# EAGLE design TopBee2.0V (EAGLE 6.5.0)
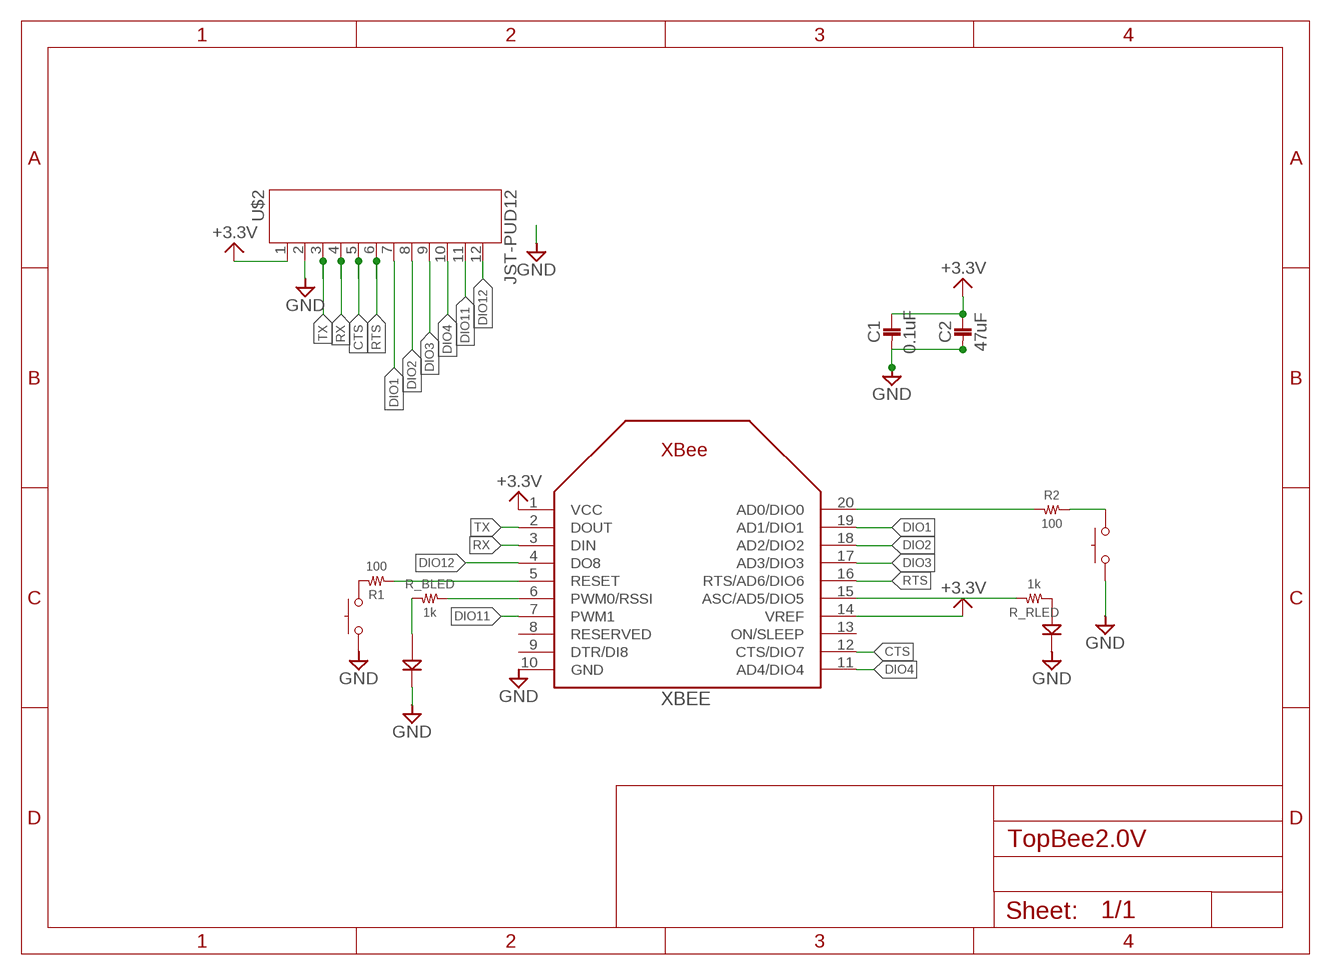
[diagram p0: schematic, sheet 1]

## Parts
C1  0.1uF  1608  [1608]
C2  47uF  3225  [3225]
COMM  SKRPACE010  [SKRP]
LED_B  1608  [1608]
LED_R  1608  [1608]
R1  100  RESISTOR__SMD  [1608]
R2  100  RESISTOR__SMD  [1608]
R_BLED  1k  RESISTOR__SMD  [1608]
R_RLED  1k  RESISTOR__SMD  [1608]
RESET  SKRPACE010  [SKRP]
U$2  JST-PUD12  [JST-PUD12]
XBEE  XBEE  [XBEE]

## Nets
+3.3V: C1.P$1 C2.P$1 U$2.1 XBEE.1(VCC) XBEE.14(VREF)
CTS: U$2.5 XBEE.12(CTS/DIO7)
DIO1: U$2.7 XBEE.19(AD1/DIO1)
DIO2: U$2.8 XBEE.18(AD2/DIO2)
DIO3: U$2.9 XBEE.17(AD3/DIO3)
DIO4: U$2.10 XBEE.11(AD4/DIO4)
DIO11: U$2.11 XBEE.7(PWM1)
DIO12: U$2.12 XBEE.4(DO8)
GND: C1.P$2 C2.P$2 COMM.3 COMM.4 LED_B.2(K) LED_R.2(K) RESET.3 RESET.4 U$2.2 XBEE.10(GND)
N$2: LED_R.1(A) R_RLED.1
N$3: R2.1 XBEE.20(AD0/DIO0)
N$4: R1.1 XBEE.5(RESET)
N$5: R1.2 RESET.1 RESET.2
N$6: COMM.1 COMM.2 R2.2
N$7: R_BLED.2 XBEE.6(PWM0/RSSI)
N$8: R_RLED.2 XBEE.15(ASC/AD5/DIO5)
N$9: LED_B.1(A) R_BLED.1
RTS: U$2.6 XBEE.16(RTS/AD6/DIO6)
RX: U$2.4 XBEE.3(DIN)
TX: U$2.3 XBEE.2(DOUT)
Unconnected: XBEE.8(RESERVED) XBEE.9(DTR/DI8) XBEE.13(ON/SLEEP)

## Library data of the parts
C1 = 02_C:1608
C2 = 02_C:3225
COMM RESET = 09_1_switch:SKRPACE010
LED_B LED_R = 10_LED:1608
R1 R2 R_BLED R_RLED = 01_R:RESISTOR__SMD
U$2 = jst-ph:JST-PUD12
XBEE = adafruit:XBEE

## Board
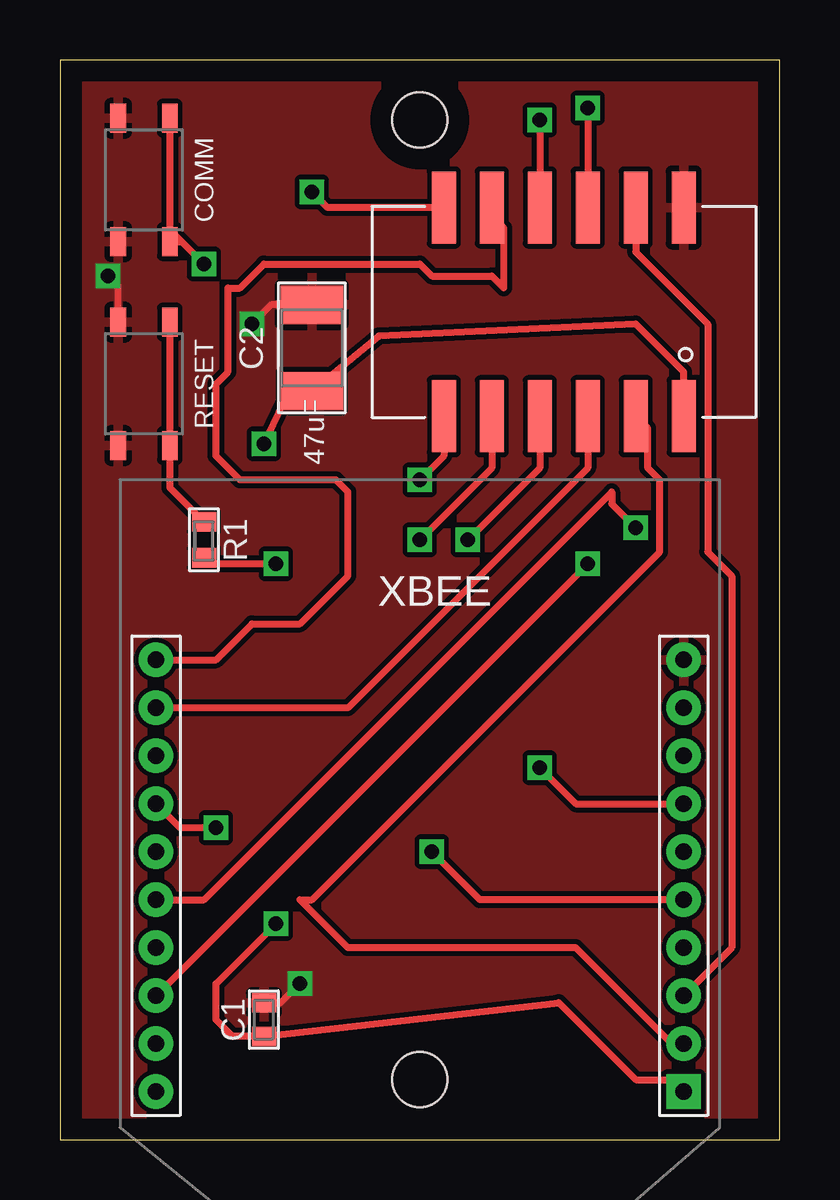
[diagram p1: board, top side]
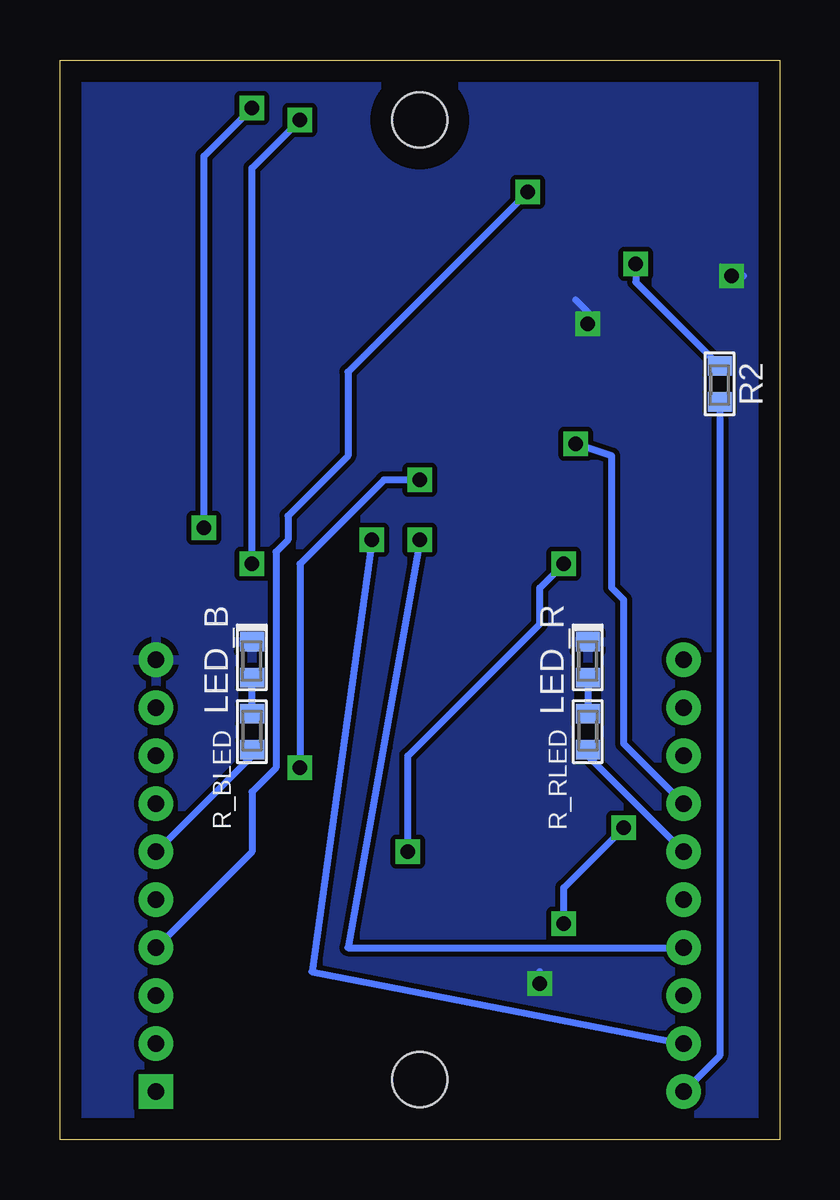
[diagram p2: board, bottom side, seen from below]

Size 30 x 45 mm. Coordinates in mm from the lower left corner, seen from the top.
Outline: 0,0 30,0 30,45 0,45 0,0
Copper layers (1*16): Top 0.035mm / dielectric 1.5mm / Bottom 0.035mm
Design rules "default *": minimum track width 10mil, minimum drill 20mil, track to track 8mil, track to pad 8mil, pad to pad 8mil, via to via 8mil, smd to smd 8mil, copper to edge 0.9mm, drill to drill 8mil, minimum pad ring 10mil, minimum via ring 8mil, stop-mask expansion 4mil, vias tented up to drill 0.5mm, thermal gap 10mil
Holes 2.3 mm at 15,2.5 15,42.5

### Footprints (pad centres in the part's own frame; a part is rotated, then mirrored left to right if it is on the bottom)
1608 = smd 0.8 x 1: P$1 -0.7,0; P$2 0.7,0
3225 = smd 1.6 x 2.6: P$1 -1.8,0; P$2 1.8,0
SKRP = smd 1.2 x 0.65: 1 -2.575,1.075; 2 2.575,1.075; 3 -2.575,-1.075; 4 2.575,-1.075
1608' = smd 0.8 x 1: 1 -0.75,0; 2 0.75,0
JST-PUD12 = smd 1 x 3: 1 5,-4.35; 2 5,4.35; 3 3,-4.35; 4 3,4.35; 5 1,-4.35; 6 1,4.35; 7 -1,-4.35; 8 -1,4.35; 9 -3,-4.35; 10 -3,4.35; 11 -5,-4.35; 12 -5,4.35
XBEE = drill 0.7 pad 1.422 square: 1 -11,5.5 | drill 0.7 pad 1.422: 2 -11,3.5; 3 -11,1.5; 4 -11,-0.5; 5 -11,-2.5; 6 -11,-4.5; 7 -11,-6.5; 8 -11,-8.5; 9 -11,-10.5; 10 -11,-12.5; 11 11,-12.5; 12 11,-10.5; 13 11,-8.5; 14 11,-6.5; 15 11,-4.5; 16 11,-2.5; 17 11,-0.5; 18 11,1.5; 19 11,3.5; 20 11,5.5

### Placement (x,y rotation side)
C1  8.5,5 90 top
C2  10.5,33 90 top
COMM  3.5,40 270 top
LED_B  1608  [1608']  22,20 90 bottom
LED_R  1608  [1608']  8,20 90 bottom
R1  100  [1608']  6,25 90 top
R2  100  [1608']  2.5,31.5 90 bottom
R_BLED  1k  [1608']  22,17 270 bottom
R_RLED  1k  [1608']  8,17 270 bottom
RESET  3.5,31.5 270 top
U$2  21,34.5 0 top
XBEE  15,7.5 180 top

### Tracks (layer width: path | path; a pad name or v marks a point on that pad's centre or on a via)
+3.3V  (via drill 0.6)
  Top 0.3: XBEE.1 25.5,2.5 24,2.5 20.8,5.7 C1.P$1 7.2,4.3 6.5,5 6.5,6.5 v9,9 | U$2.1 26,32 24,34 13.3,33.5 C2.P$1 9.7,31.5 v8.5,29 | v6.5,13 5,13 XBEE.14
  Bottom 0.3: XBEE.14 6.5,16.5 6.5,22.5 7,23 7,28.5 v8.5,29 | v9,9 9,10.5 v6.5,13
CTS
  Top 0.3: U$2.5 22,28 12,18 XBEE.12
DIO1  (via drill 0.6)
  Top 0.3: U$2.7 20,28 v17,25
  Bottom 0.3: v17,25 19.5,7 XBEE.19
DIO2  (via drill 0.6)
  Top 0.3: XBEE.18 v22,24 | v20,42.5 U$2.8
  Bottom 0.3: v22,24 22,40.5 v20,42.5
DIO3  (via drill 0.6)
  Top 0.3: U$2.9 18,28 v15,25
  Bottom 0.3: v15,25 18,8 XBEE.17
DIO4
  Top 0.3: XBEE.11 6.5,20 8,21.5 10,21.5 12,23.5 12,27 11.5,27.5 7.5,27.5 6.5,28.5 6.5,31.5 7,32 7,35.5 7.5,35.5 8.5,36.5 15,36.5 15.5,36 18,36 18.5,35.5 18.5,38 18,38.5 U$2.10
DIO11  (via drill 0.6)
  Top 0.3: U$2.11 16,28.5 v15,27.5 | v20,15.5 21.5,14 XBEE.7
  Bottom 0.3: v15,27.5 16.5,27.5 20,24 v20,15.5
DIO12  (via drill 0.6)
  Top 0.3: U$2.12 11.15,38.85 v10.5,39.5
  Bottom 0.3: v10.5,39.5 18,32 18,28.5 20.5,26 20.5,25 21,24.5 21,15.5 22,14.5 22,12 XBEE.4
GND  (via drill 0.6)
  Top 0.3: C1.P$2 9.2,5.7 v10,6.5 | C2.P$2 8.8,34.8 v8,34 | RESET.3 2.42,35.58 v2,36
  Bottom 0.3: v10,6.5 10,7 | v8,34 8,34.5 8.5,35 | v2,36 1.5,36
  pour Top: 0,45 30,45 30,0 0,0
  pour Bottom: 0,45 30,45 30,0 0,0
N$2
  Bottom 0.3: LED_R.1 R_RLED.1
N$3
  Bottom 0.3: R2.1 2.5,3.5 XBEE.20
N$4  (via drill 0.6)
  Top 0.3: XBEE.5 17.5,10 v15.5,12 | v9,24 6.25,24 R1.1
  Bottom 0.3: v15.5,12 15.5,16 10,21.5 10,23 v9,24
N$5
  Top 0.3: RESET.1 RESET.2 4.58,27.18 R1.2
N$6  (via drill 0.6)
  Top 0.3: COMM.2 5.08,37.42 | 5.08,37.42 5.25,37.25 v6,36.5 | COMM.1 4.58,37.92 5.08,37.42
  Bottom 0.3: v6,36.5 6,35.75 R2.2
N$7
  Bottom 0.3: R_BLED.2 22,16 XBEE.6
N$8
  Bottom 0.3: R_RLED.2 8,16 XBEE.15
N$9
  Bottom 0.3: R_BLED.1 LED_B.1
RTS  (via drill 0.6)
  Top 0.3: XBEE.16 6,10 23,27 23,26.5 v24,25.5 | v22,43 U$2.6
  Bottom 0.3: v24,25.5 24,41 v22,43
RX
  Top 0.3: U$2.4 24,37 27,34 27,24.5 28,23.5 28,8 XBEE.3
TX
  Top 0.3: XBEE.2 25.5,4 21.5,8 12,8 10,10 10.5,10 25,24.5 25,27.5 24.5,28 24.5,29.65 U$2.3